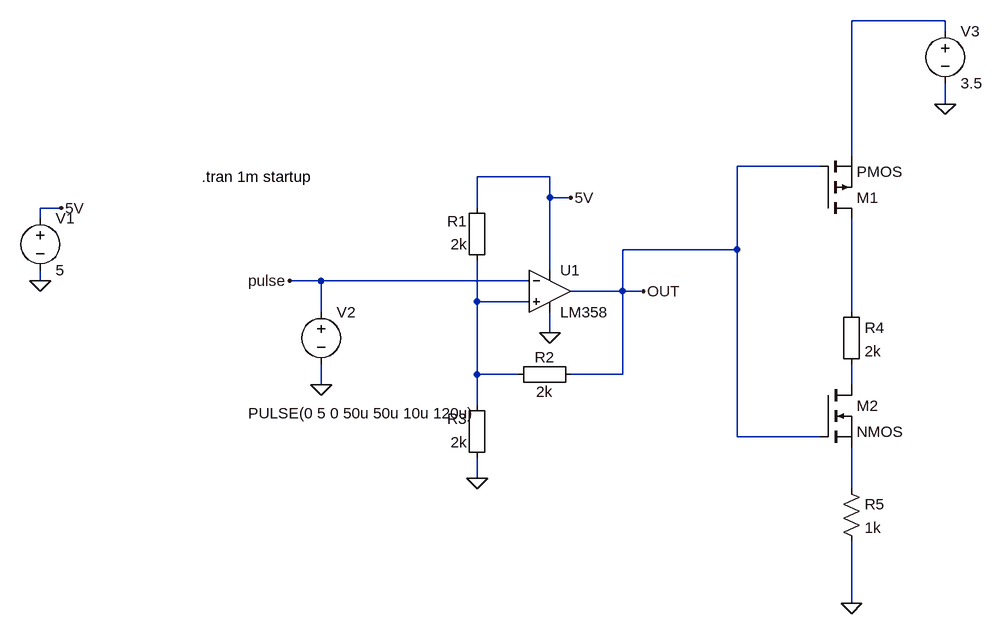
[diagram p0: schematic LM358 Schmitt Trigger V1.asc]
LM358 Schmitt Trigger V1.asc, the LTspice schematic file:
Version 4
SHEET 1 1088 680
WIRE 688 -256 544 -256
WIRE 688 -240 688 -256
WIRE 688 -128 688 -160
WIRE 544 -48 544 -256
WIRE 496 -32 368 -32
WIRE 80 -16 -32 -16
WIRE 80 16 80 -16
WIRE 112 16 80 16
WIRE -672 32 -704 32
WIRE -32 32 -32 -16
WIRE -704 48 -704 32
WIRE 368 96 368 -32
WIRE 368 96 192 96
WIRE 80 128 80 16
WIRE -704 144 -704 128
WIRE -272 144 -320 144
WIRE 48 144 -272 144
WIRE 192 160 192 96
WIRE 192 160 112 160
WIRE 224 160 192 160
WIRE -32 176 -32 112
WIRE 48 176 -32 176
WIRE -272 192 -272 144
WIRE 544 192 544 48
WIRE 80 224 80 192
WIRE -32 288 -32 176
WIRE 32 288 -32 288
WIRE 192 288 192 160
WIRE 192 288 112 288
WIRE -272 304 -272 272
WIRE 544 304 544 272
WIRE -32 336 -32 288
WIRE 368 384 368 96
WIRE 496 384 368 384
WIRE -32 448 -32 416
WIRE 544 464 544 400
WIRE 544 640 544 544
FLAG -672 32 5V
FLAG -704 144 0
FLAG 112 16 5V
FLAG 80 224 0
FLAG 224 160 OUT
FLAG -272 304 0
FLAG -32 448 0
FLAG -320 144 pulse
FLAG 688 -128 0
FLAG 544 640 0
SYMBOL OpAmp\\LM358 80 160 R0
SYMATTR InstName U1
SYMBOL voltage -704 32 R0
WINDOW 123 0 0 Left 0
WINDOW 39 0 0 Left 0
SYMATTR InstName V1
SYMATTR Value 5
SYMBOL Misc\\EuropeanResistor 128 272 R90
WINDOW 0 5 56 VBottom 2
WINDOW 3 27 56 VTop 2
SYMATTR InstName R2
SYMATTR Value 2k
SYMBOL Misc\\EuropeanResistor -16 128 R180
WINDOW 0 31 76 Left 2
WINDOW 3 31 40 Left 2
SYMATTR InstName R1
SYMATTR Value 2k
SYMBOL voltage -272 176 R0
WINDOW 3 -112 172 Left 2
WINDOW 123 0 0 Left 0
WINDOW 39 0 0 Left 0
SYMATTR Value PULSE(0 5 0 50u 50u 10u 120u)
SYMATTR InstName V2
SYMBOL Misc\\EuropeanResistor -16 432 R180
WINDOW 0 31 76 Left 2
WINDOW 3 31 40 Left 2
SYMATTR InstName R3
SYMATTR Value 2k
SYMBOL pmos 496 48 M180
SYMATTR InstName M1
SYMBOL voltage 688 -256 R0
WINDOW 123 0 0 Left 0
WINDOW 39 0 0 Left 0
SYMATTR InstName V3
SYMATTR Value 3.5
SYMBOL nmos 496 304 R0
SYMATTR InstName M2
SYMBOL Misc\\EuropeanResistor 528 176 R0
SYMATTR InstName R4
SYMATTR Value 2k
SYMBOL res 528 448 R0
SYMATTR InstName R5
SYMATTR Value 1k
TEXT -456 -16 Left 2 !.tran 1m startup

The netlist it stands for:
* LM358 Schmitt Trigger V1.asc
XU1 N002 pulse 5V 0 OUT LM358  ; pins In+ In- V+ V- OUT
V1 5V 0 5
R2 OUT N002 2k
R1 N002 5V 2k
V2 pulse 0 PULSE(0 5 0 50u 50u 10u 120u)
R3 0 N002 2k
M1 N003 OUT N001 N001 PMOS
V3 N001 0 3.5
M2 N004 OUT N005 N005 NMOS
R4 N003 N004 2k
R5 N005 0 1k
.model NMOS NMOS
.model PMOS PMOS
.lib standard.mos
.tran 1m startup
.backanno
.end